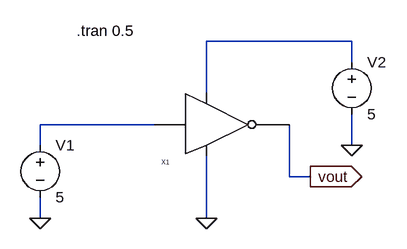
[diagram p0: schematic Draft1.asc]
Draft1.asc, the LTspice schematic file:
Version 4.1
SHEET 1 880 680
WIRE 400 -16 176 -16
WIRE 400 16 400 -16
WIRE 176 64 176 -16
WIRE 96 112 -80 112
WIRE -80 144 -80 112
WIRE 400 144 400 96
WIRE 304 192 304 112
WIRE 336 192 304 192
WIRE -80 256 -80 224
WIRE 176 256 176 160
FLAG -80 256 0
FLAG 176 256 0
FLAG 400 144 0
FLAG 336 192 vout
IOPIN 336 192 Out
SYMBOL voltage -80 128 R0
WINDOW 123 0 0 Left 0
WINDOW 39 0 0 Left 0
SYMATTR InstName V1
SYMATTR Value 5
SYMBOL voltage 400 0 R0
WINDOW 123 0 0 Left 0
WINDOW 39 0 0 Left 0
SYMATTR InstName V2
SYMATTR Value 5
SYMBOL Inv 208 128 R0
SYMATTR InstName X1
TEXT -24 -32 Left 2 !.tran 0.5

The netlist it stands for:
* Draft1.asc
V1 N002 0 5
V2 N001 0 5
X§X1 N002 N001 0 vout Inv  ; pins vin vdd vss vout
.tran 0.5
.backanno
.end